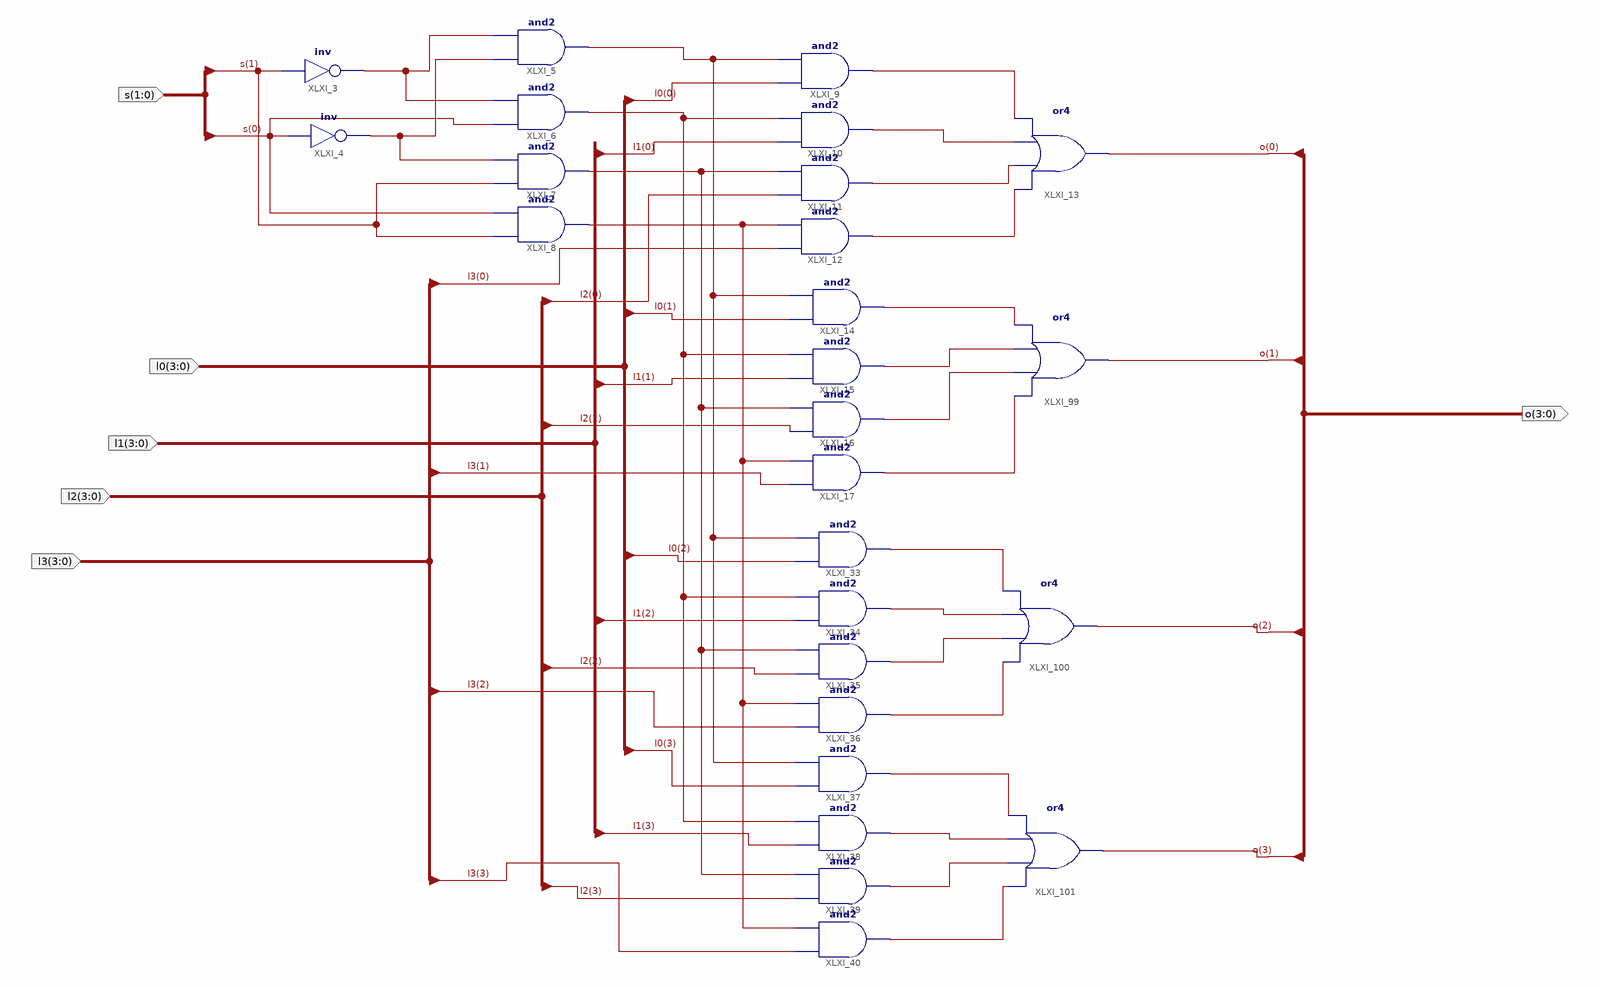
[diagram p0: schematic sheet 1]
// Xilinx ISE schematic Mux4to14b.sch (kintex7) as structural Verilog: 26 symbols, 6 ports
module Mux4to14b (
  input  [1:0] s,
  input  [3:0] l0,
  input  [3:0] l1,
  input  [3:0] l2,
  input  [3:0] l3,
  output [3:0] o
);

  wire XLXN_19, XLXN_23, XLXN_24, XLXN_25, XLXN_26, XLXN_56, XLXN_64, XLXN_67, XLXN_150, XLXN_151, XLXN_152,
       XLXN_155, XLXN_156, XLXN_157, XLXN_158, XLXN_159, XLXN_160, XLXN_161, XLXN_162, XLXN_163, XLXN_174,
       XLXN_175;

  not XLXI_3 (XLXN_174, s[1]);
  not XLXI_4 (XLXN_175, s[0]);
  and XLXI_5 (XLXN_56, XLXN_175, XLXN_174);
  and XLXI_6 (XLXN_19, s[0], XLXN_174);
  and XLXI_7 (XLXN_64, s[1], XLXN_175);
  and XLXI_8 (XLXN_67, s[1], s[0]);
  and XLXI_9 (XLXN_23, l0[0], XLXN_56);
  and XLXI_10 (XLXN_24, l1[0], XLXN_19);
  and XLXI_11 (XLXN_25, l2[0], XLXN_64);
  and XLXI_12 (XLXN_26, l3[0], XLXN_67);
  or XLXI_13 (o[0], XLXN_26, XLXN_25, XLXN_24, XLXN_23);
  and XLXI_14 (XLXN_150, l0[1], XLXN_56);
  and XLXI_15 (XLXN_151, l1[1], XLXN_19);
  and XLXI_16 (XLXN_152, l2[1], XLXN_64);
  and XLXI_17 (XLXN_155, l3[1], XLXN_67);
  and XLXI_33 (XLXN_156, l0[2], XLXN_56);
  and XLXI_34 (XLXN_157, l1[2], XLXN_19);
  and XLXI_35 (XLXN_158, l2[2], XLXN_64);
  and XLXI_36 (XLXN_159, l3[2], XLXN_67);
  and XLXI_37 (XLXN_160, l0[3], XLXN_56);
  and XLXI_38 (XLXN_161, l1[3], XLXN_19);
  and XLXI_39 (XLXN_162, l2[3], XLXN_64);
  and XLXI_40 (XLXN_163, l3[3], XLXN_67);
  or XLXI_99 (o[1], XLXN_155, XLXN_152, XLXN_151, XLXN_150);
  or XLXI_100 (o[2], XLXN_159, XLXN_158, XLXN_157, XLXN_156);
  or XLXI_101 (o[3], XLXN_163, XLXN_162, XLXN_161, XLXN_160);
endmodule
